# Altium schematic sheet Mezz_connector.SchDoc: RP2040 CNC
size B; Author: AM; CompanyName: Expatria Technologies; DrawnBy: A.Marles; Engineer: AM; Organization: Expatria Technolgoies; DocumentNumber: 7; SheetNumber: 7; SheetTotal: 14
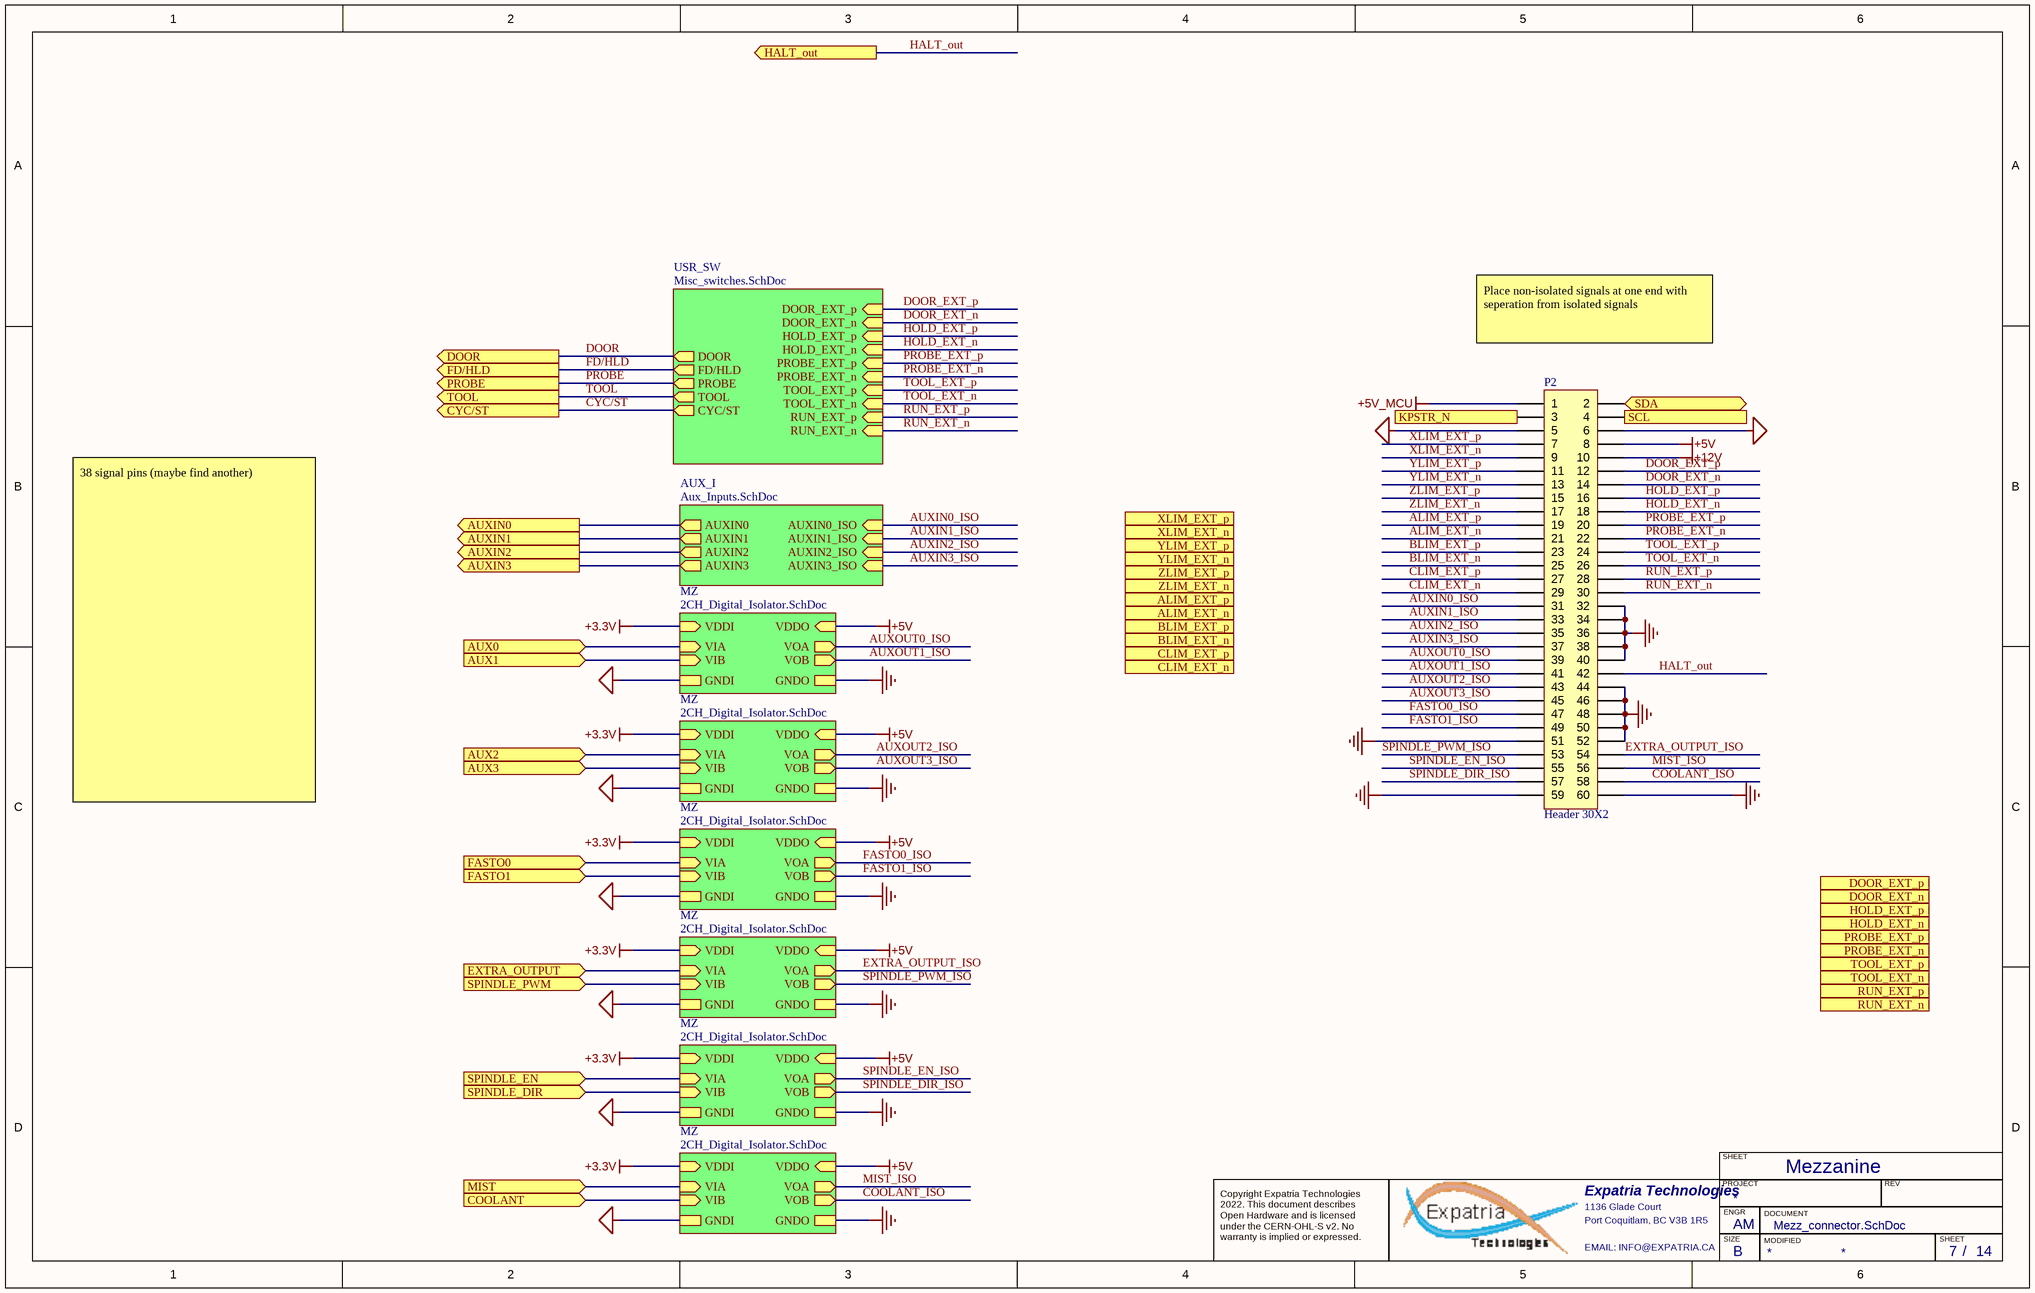
[diagram p0: Mezz_connector.SchDoc]

## Parts
P2  Header 30X2  [HDR2X30]

## Sub-sheets
AUX_I = Aux_Inputs.SchDoc: AUXIN3 (out), AUXIN0 (out), AUXIN1 (out), AUXIN2 (out), AUXIN0_ISO (in), AUXIN3_ISO (in), AUXIN1_ISO (in), AUXIN2_ISO (in)
MZ = 2CH_Digital_Isolator.SchDoc: VDDO (in), VIB (in), VIA (in), VOB (out), VOA (out), VDDI (in), GNDO, GNDI
MZ = 2CH_Digital_Isolator.SchDoc: VDDO (in), VIB (in), VIA (in), VOB (out), VOA (out), VDDI (in), GNDO, GNDI
MZ = 2CH_Digital_Isolator.SchDoc: VDDO (in), VIB (in), VIA (in), VOB (out), VOA (out), VDDI (in), GNDO, GNDI
MZ = 2CH_Digital_Isolator.SchDoc: VDDO (in), VIB (in), VIA (in), VOB (out), VOA (out), VDDI (in), GNDO, GNDI
MZ = 2CH_Digital_Isolator.SchDoc: VDDO (in), VIB (in), VIA (in), VOB (out), VOA (out), VDDI (in), GNDO, GNDI
MZ = 2CH_Digital_Isolator.SchDoc: VDDO (in), VIB (in), VIA (in), VOB (out), VOA (out), VDDI (in), GNDO, GNDI
USR_SW = Misc_switches.SchDoc: FD/HLD (out), PROBE (out), CYC/ST (out), DOOR (out), TOOL (out), PROBE_EXT_n (in), RUN_EXT_p (in), PROBE_EXT_p (in), DOOR_EXT_n (in), TOOL_EXT_n (in), TOOL_EXT_p (in), HOLD_EXT_n (in), RUN_EXT_n (in), HOLD_EXT_p (in), DOOR_EXT_p (in)

## Ports
ALIM_EXT_n (in), ALIM_EXT_p (in), AUX0 (in), AUX1 (in), AUX2 (in), AUX3 (in), AUXIN0 (out), AUXIN1 (out), AUXIN2 (out), AUXIN3 (out), BLIM_EXT_n (in), BLIM_EXT_p (in), CLIM_EXT_n (in), CLIM_EXT_p (in), COOLANT (in), CYC/ST (out), DOOR (out), DOOR_EXT_n (in), DOOR_EXT_p (in), EXTRA_OUTPUT (in), FASTO0 (in), FASTO1 (in), FD/HLD (out), HALT_out (out), HOLD_EXT_n (in), HOLD_EXT_p (in), KPSTR_N (out), MIST (in), PROBE (out), PROBE_EXT_n (in), PROBE_EXT_p (in), RUN_EXT_n (in), RUN_EXT_p (in), SCL (in), SDA (bidir), SPINDLE_DIR (in), SPINDLE_EN (in), SPINDLE_PWM (in), TOOL (out), TOOL_EXT_n (in), TOOL_EXT_p (in), XLIM_EXT_n (in), XLIM_EXT_p (in), YLIM_EXT_n (in), YLIM_EXT_p (in), ZLIM_EXT_n (in), ZLIM_EXT_p (in)

## Nets
+3.3V: sheet MZ/VDDI, sheet MZ/VDDI, sheet MZ/VDDI, sheet MZ/VDDI, sheet MZ/VDDI, sheet MZ/VDDI
+5V: P2.8 ; sheet MZ/VDDO, sheet MZ/VDDO, sheet MZ/VDDO, sheet MZ/VDDO, sheet MZ/VDDO, sheet MZ/VDDO
+5V_MCU: P2.1
+12V: P2.10
GND: P2.32 P2.34 P2.36 P2.38 P2.40 P2.44 P2.46 P2.48 P2.50 P2.51 P2.52 P2.59 P2.60 ; sheet MZ/GNDO, sheet MZ/GNDO, sheet MZ/GNDO, sheet MZ/GNDO, sheet MZ/GNDO, sheet MZ/GNDO
MCU_GND: P2.5 P2.6 ; sheet MZ/GNDI, sheet MZ/GNDI, sheet MZ/GNDI, sheet MZ/GNDI, sheet MZ/GNDI, sheet MZ/GNDI
ALIM_EXT_n: P2.21
ALIM_EXT_p: P2.19
AUX0: port AUX0, sheet MZ/VIA
AUX1: port AUX1, sheet MZ/VIB
AUX2: port AUX2, sheet MZ/VIA
AUX3: port AUX3, sheet MZ/VIB
AUXIN0: port AUXIN0, sheet AUX_I/AUXIN0
AUXIN0_ISO: P2.31 ; sheet AUX_I/AUXIN0_ISO
AUXIN1: port AUXIN1, sheet AUX_I/AUXIN1
AUXIN1_ISO: P2.33 ; sheet AUX_I/AUXIN1_ISO
AUXIN2: port AUXIN2, sheet AUX_I/AUXIN2
AUXIN2_ISO: P2.35 ; sheet AUX_I/AUXIN2_ISO
AUXIN3: port AUXIN3, sheet AUX_I/AUXIN3
AUXIN3_ISO: P2.37 ; sheet AUX_I/AUXIN3_ISO
AUXOUT0_ISO: P2.39 ; sheet MZ/VOA
AUXOUT1_ISO: P2.41 ; sheet MZ/VOB
AUXOUT2_ISO: P2.43 ; sheet MZ/VOA
AUXOUT3_ISO: P2.45 ; sheet MZ/VOB
BLIM_EXT_n: P2.25
BLIM_EXT_p: P2.23
CLIM_EXT_n: P2.29
CLIM_EXT_p: P2.27
COOLANT: port COOLANT, sheet MZ/VIB
COOLANT_ISO: P2.58 ; sheet MZ/VOB
CYC/ST: port CYC/ST, sheet USR_SW/CYC/ST
DOOR: port DOOR, sheet USR_SW/DOOR
DOOR_EXT_n: P2.14 ; sheet USR_SW/DOOR_EXT_n
DOOR_EXT_p: P2.12 ; sheet USR_SW/DOOR_EXT_p
EXTRA_OUTPUT: port EXTRA_OUTPUT, sheet MZ/VIA
EXTRA_OUTPUT_ISO: P2.54 ; sheet MZ/VOA
FASTO0: port FASTO0, sheet MZ/VIA
FASTO0_ISO: P2.47 ; sheet MZ/VOA
FASTO1: port FASTO1, sheet MZ/VIB
FASTO1_ISO: P2.49 ; sheet MZ/VOB
FD/HLD: port FD/HLD, sheet USR_SW/FD/HLD
HALT_out: P2.42 ; port HALT_out
HOLD_EXT_n: P2.18 ; sheet USR_SW/HOLD_EXT_n
HOLD_EXT_p: P2.16 ; sheet USR_SW/HOLD_EXT_p
KPSTR_N: P2.3 ; port KPSTR_N
MIST: port MIST, sheet MZ/VIA
MIST_ISO: P2.56 ; sheet MZ/VOA
PROBE: port PROBE, sheet USR_SW/PROBE
PROBE_EXT_n: P2.22 ; sheet USR_SW/PROBE_EXT_n
PROBE_EXT_p: P2.20 ; sheet USR_SW/PROBE_EXT_p
RUN_EXT_n: P2.30 ; sheet USR_SW/RUN_EXT_n
RUN_EXT_p: P2.28 ; sheet USR_SW/RUN_EXT_p
SCL: P2.4 ; port SCL
SDA: P2.2 ; port SDA
SPINDLE_DIR: port SPINDLE_DIR, sheet MZ/VIB
SPINDLE_DIR_ISO: P2.57 ; sheet MZ/VOB
SPINDLE_EN: port SPINDLE_EN, sheet MZ/VIA
SPINDLE_EN_ISO: P2.55 ; sheet MZ/VOA
SPINDLE_PWM: port SPINDLE_PWM, sheet MZ/VIB
SPINDLE_PWM_ISO: P2.53 ; sheet MZ/VOB
TOOL: port TOOL, sheet USR_SW/TOOL
TOOL_EXT_n: P2.26 ; sheet USR_SW/TOOL_EXT_n
TOOL_EXT_p: P2.24 ; sheet USR_SW/TOOL_EXT_p
XLIM_EXT_n: P2.9
XLIM_EXT_p: P2.7
YLIM_EXT_n: P2.13
YLIM_EXT_p: P2.11
ZLIM_EXT_n: P2.17
ZLIM_EXT_p: P2.15

## Notes on the sheet
- Place non-isolated signals at one end with seperation from isolated signals
- 38 signal pins (maybe find another)
- Mezzanine
- SHEET
- Expatria Technologies
- 1136 Glade Court
- Port Coquitlam, BC V3B 1R5
- PROJECT
- SIZE
- ENGR
- MODIFIED
- DOCUMENT
- REV
- Copyright Expatria Technologies 2022. This document describes Open Hardware and is licensed under the CERN-OHL-S v2. No warranty is implied or expressed.
- EMAIL: INFO@EXPATRIA.CA
- B
- /

## Library data of the parts
P2 = Header 30X2: Header, 30-Pin, Dual row; LatestRevisionDate: 17-Jul-2002; LatestRevisionNote: Re-released for DXP Platform.; Publisher: Altium Limited